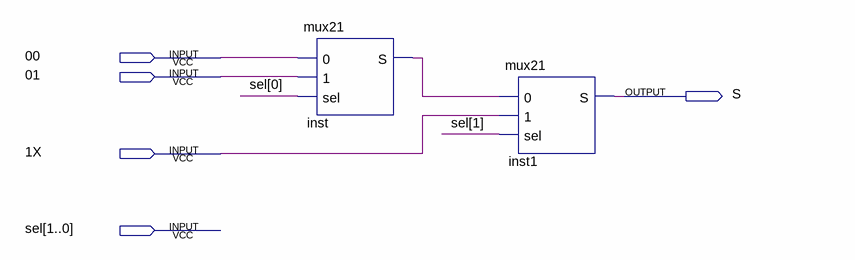
[diagram p0: schematic sheet]
// Quartus schematic mux31.bdf as structural Verilog: 2 symbols, 5 pins
module mux31 (
  input  \00 ,
  input  \01 ,
  input  \1X ,
  input  [1:0] sel,
  output S
);

  wire inst_s;

  mux21 inst (.\0 (\00 ), .\1 (\01 ), .sel(sel[0]), .S(inst_s));
  mux21 inst1 (.\0 (inst_s), .\1 (\1X ), .sel(sel[1]), .S(S));
endmodule
